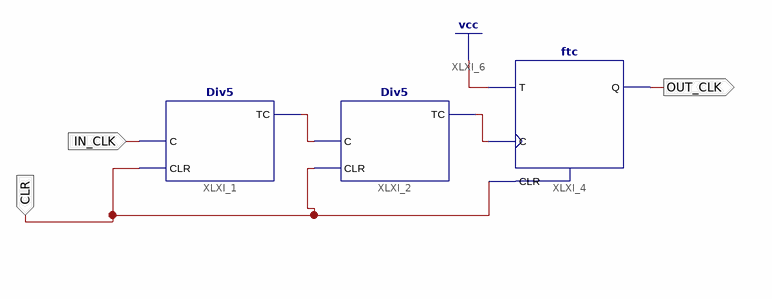
[diagram p0: schematic sheet 1]
// Xilinx ISE schematic Div50.sch (spartan6) as structural Verilog: 3 symbols, 3 ports
module Div50 (
  input  IN_CLK,
  input  CLR,
  output OUT_CLK
);

  wire XLXN_1, XLXN_6;

  Div5 XLXI_1 (.C(IN_CLK), .CLR(CLR), .TC(XLXN_1));
  Div5 XLXI_2 (.C(XLXN_1), .CLR(CLR), .TC(XLXN_6));
  ftc XLXI_4 (.C(XLXN_6), .CLR(CLR), .T(1'b1), .Q(OUT_CLK));
endmodule
